# EAGLE board Replicape_B0 (EAGLE 7.2.0), part 1 of 2
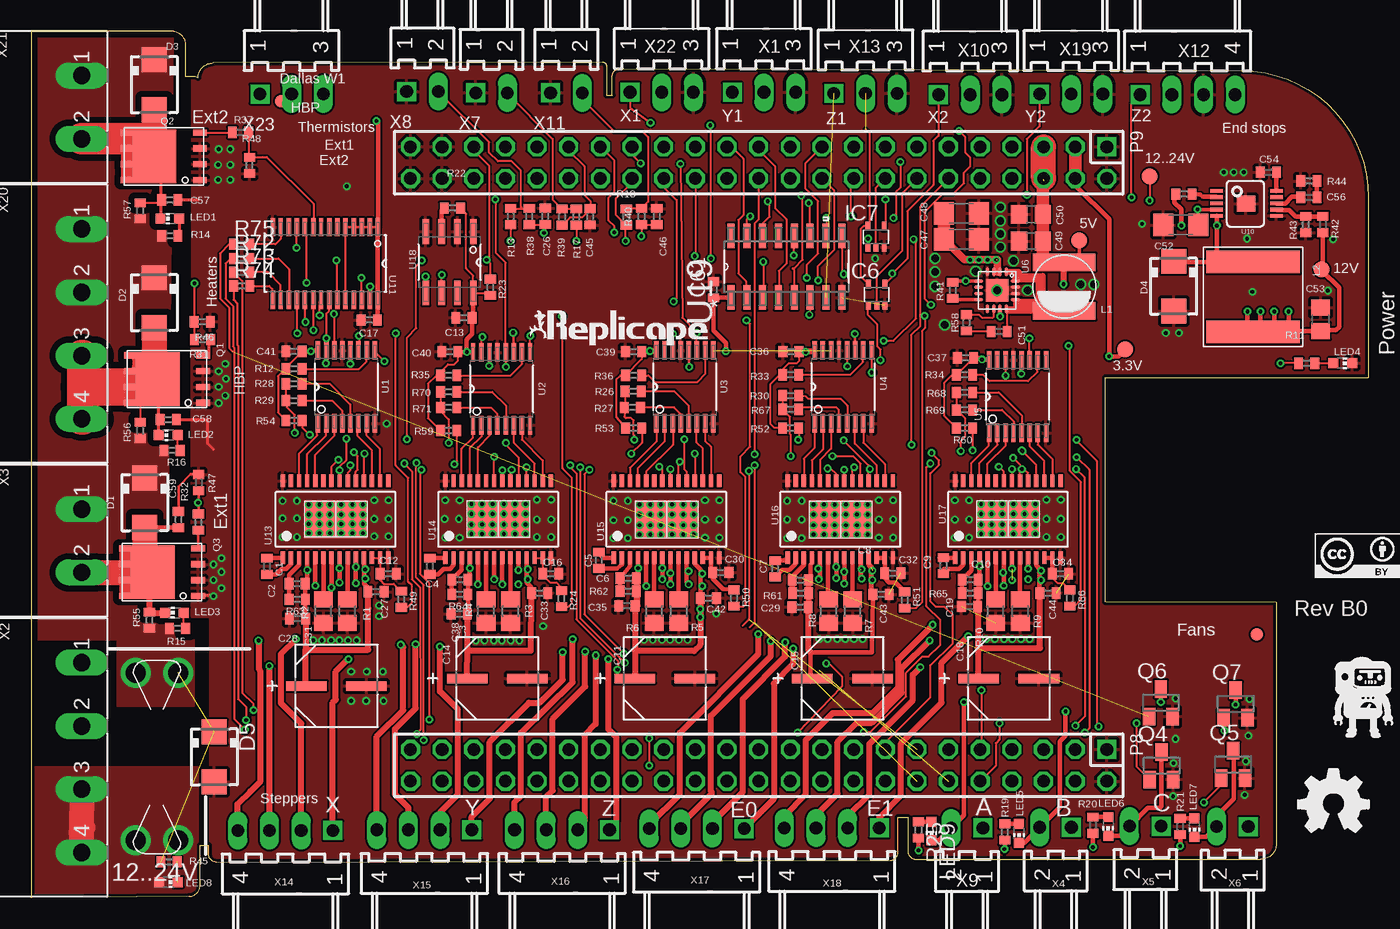
[diagram p5: board, top side]
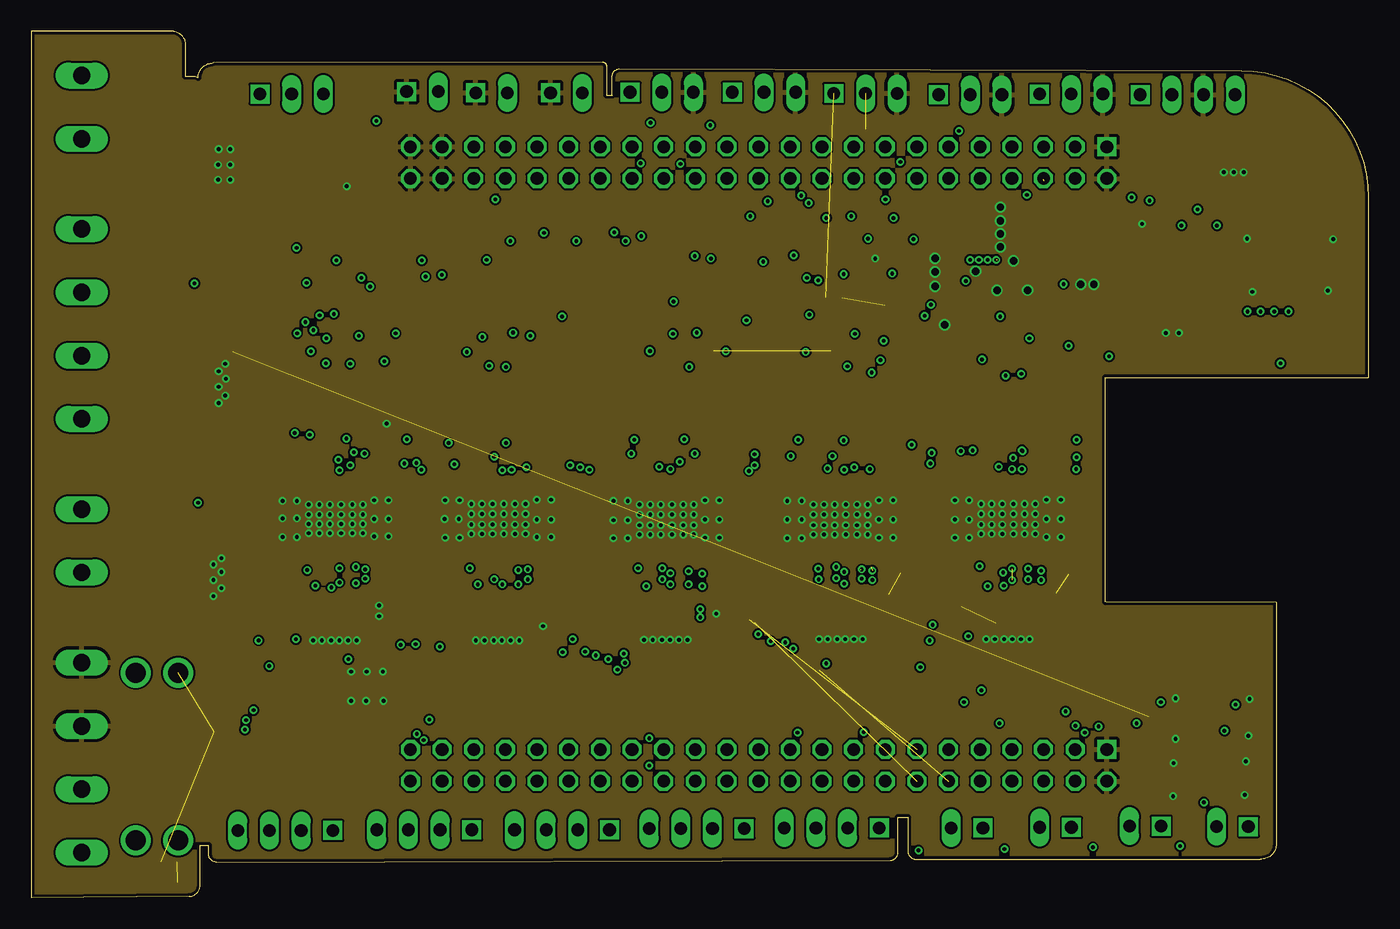
[diagram p6: board, inner layer GND]
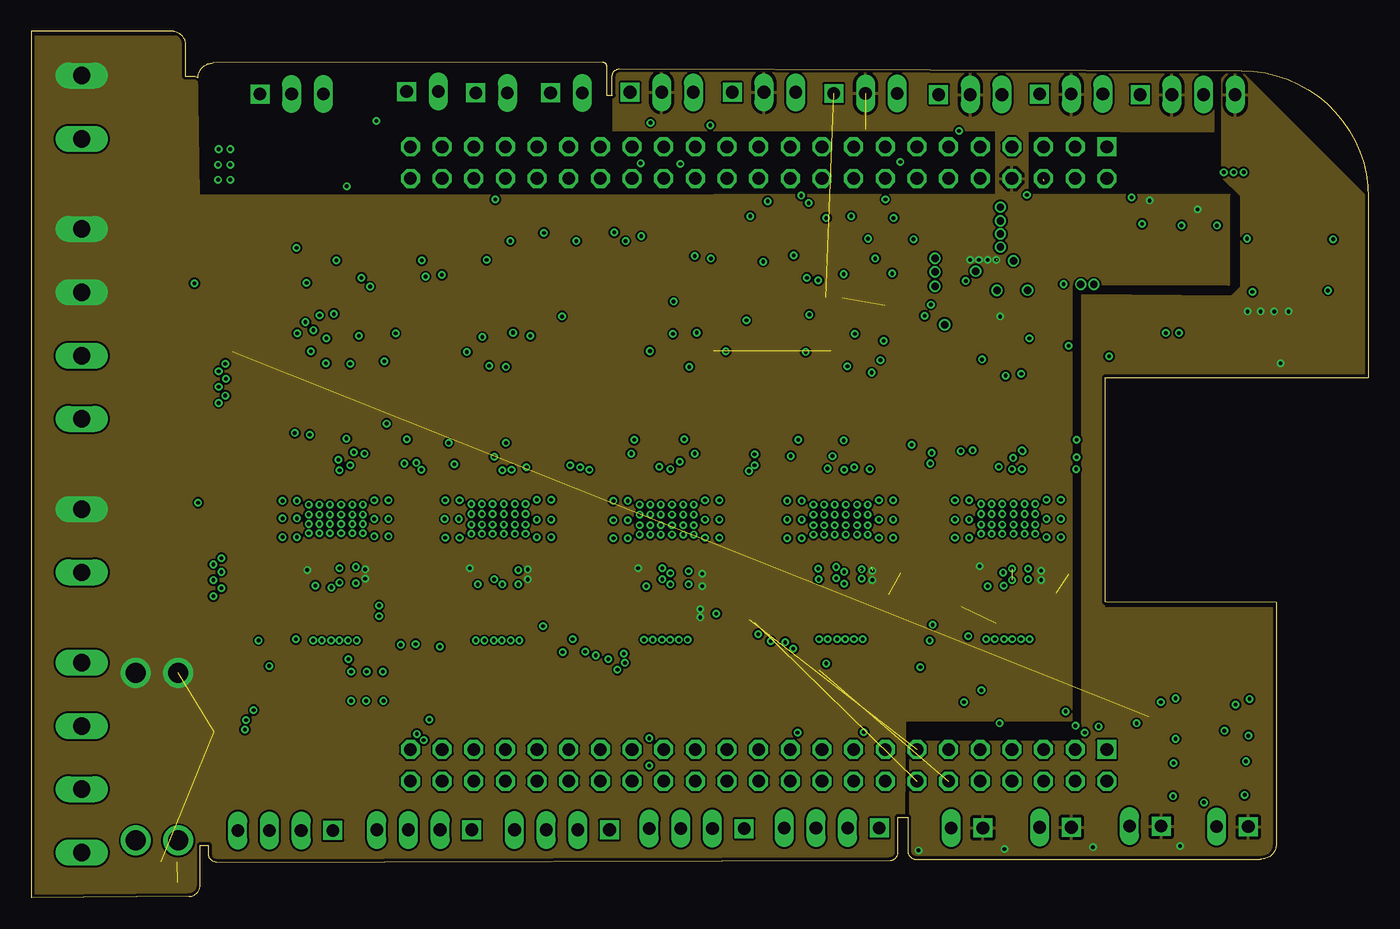
[diagram p7: board, inner layer VCC]
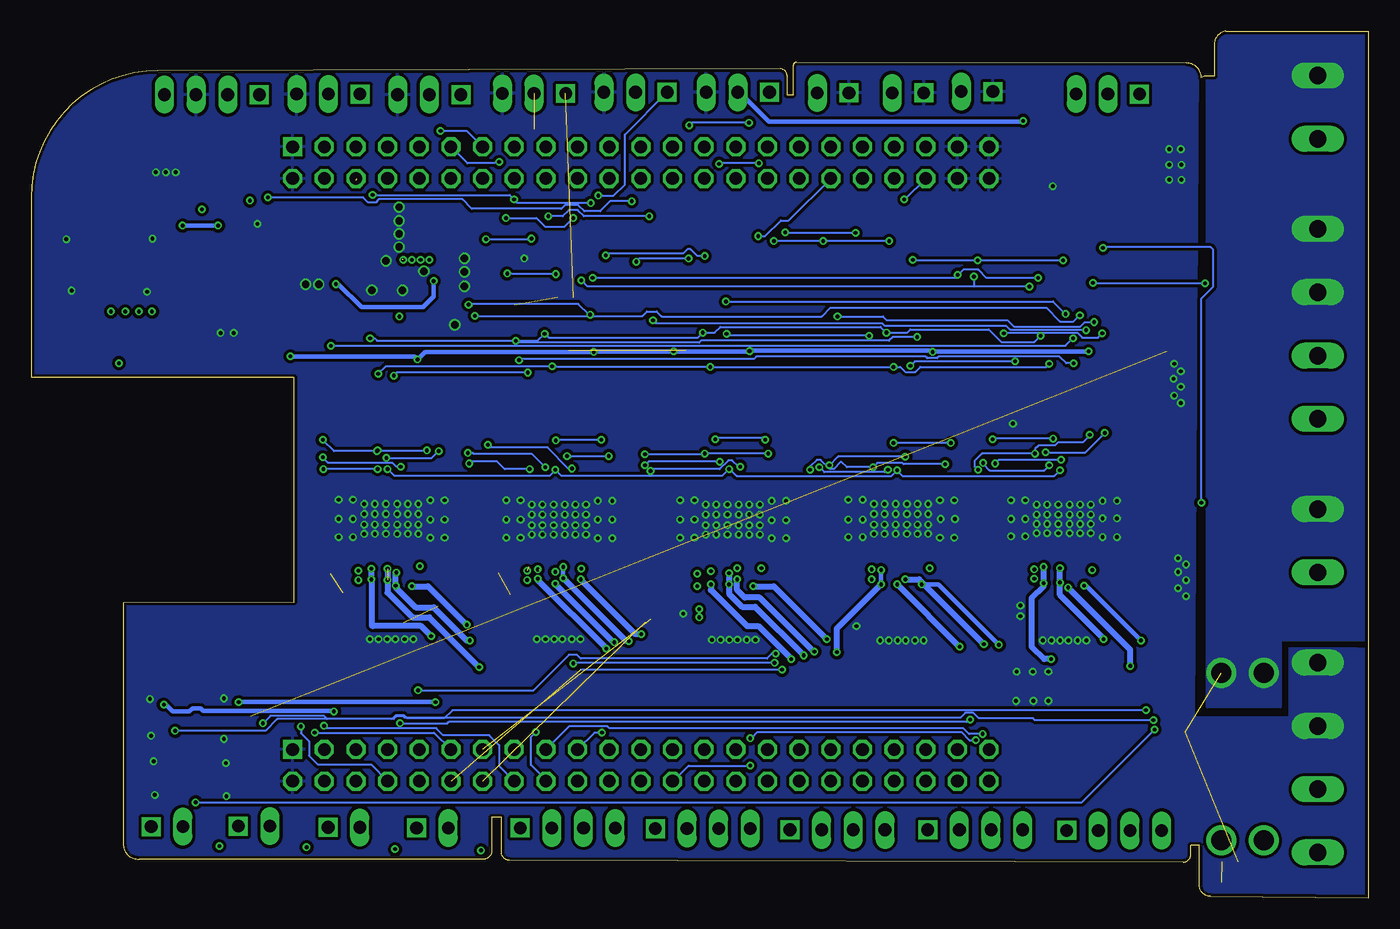
[diagram p8: board, bottom side, seen from below]

Size 107.3 x 69.55 mm. Coordinates in mm from the lower left corner, seen from the top.
Outline: 46.62,64.4 46.62,65.85 arc-90 47.17,66.53 97.15,66.38 arc-90 107.3,56.2 107.3,41.75 86.19,41.75 86.19,23.75 99.9,23.7 99.9,4.2 arc-90 98.65,3.1 70.95,3.1 arc-90 70.35,3.75 70.35,6.45 69.55,6.45 69.55,3.65 arc-90 68.95,3 14.85,2.85 arc-90 14.25,3.5 14.25,4.2 13.55,4.2 13.55,1.05 arc-90 12.7,0.1 0,0 0,69.55 11.43,69.55 arc-90 12.35,68.35 12.35,65.95 13.15,65.95 13.4,65.8 arc-90 14.6,67 45.9,67.05 arc-90 46.15,66.8 46.15,64.4 46.62,64.4
Outline: 46.62,64.4 46.65,64.4
Copper layers (1*2*3*16): Top 0.035mm / dielectric 0.2mm / GND 0.035mm / dielectric 1.06mm / VCC 0.035mm / dielectric 0.2mm / Bottom 0.035mm
Design rules "default *": minimum track width 6mil, minimum drill 0.3mm, track to track 6mil, track to pad 6mil, pad to pad 6mil, via to via 6mil, smd to smd 0mil, copper to edge 10mil, drill to drill 10mil, minimum pad ring 10mil, minimum via ring 6mil, stop-mask expansion 2mil, vias tented up to drill 100mil, thermal gap 10mil
Net classes: 1 power: width 1.27 mm

## Footprints (pad centres in the part's own frame; a part is rotated, then mirrored left to right if it is on the bottom)
B1,27 = smd 1.27 x 1.27: TP 0,0
C0402 = smd 0.7 x 0.9: 1 -0.65,0; 2 0.65,0
CAPAE660X800N = smd 3.251 x 0.762: 1 -2.413,0; 2 2.413,0
C1206 = smd 1.6 x 1.8: 1 -1.4,0; 2 1.4,0
C0805 = smd 1.3 x 1.5: 1 -0.95,0; 2 0.95,0
SMA = smd 2 x 2: A 2,0; C -2,0
3557 = drill 1.6: P$1 -6.73,1.7; P$2 -6.73,-1.7; P$3 6.73,-1.7; P$4 6.73,1.7
SC70-5 = smd 0.4 x 0.7: 1 -0.65,-0.85; 2 0,-0.85; 3 0.65,-0.85; 4 0.65,0.85; 5 -0.65,0.85
FIDUCIAL-1X2.5 = smd 1 x 1: 1 0,0
VLC5020 = smd 1.4 x 5: P$1 1.95,0; P$2 -1.95,0
NR8040T330 = smd 1.8 x 7.5: P$1 2.8,0; P$2 -2.8,0
CHIP-LED0603 = smd 0.8 x 0.8: A 0,-0.75; C 0,0.75
DIL-100-2X23 = drill 1.016 square: 1 -27.94,-1.27 | drill 1.016 octagon: 2 -27.94,1.27; 3 -25.4,-1.27; 4 -25.4,1.27; 5 -22.86,-1.27; 6 -22.86,1.27; 7 -20.32,-1.27; 8 -20.32,1.27; 9 -17.78,-1.27; 10 -17.78,1.27; 11 -15.24,-1.27; 12 -15.24,1.27; 13 -12.7,-1.27; 14 -12.7,1.27; 15 -10.16,-1.27; 16 -10.16,1.27; 17 -7.62,-1.27; 18 -7.62,1.27; 19 -5.08,-1.27; 20 -5.08,1.27; 21 -2.54,-1.27; 22 -2.54,1.27; 23 0,-1.27; 24 0,1.27; 25 2.54,-1.27; 26 2.54,1.27; 27 5.08,-1.27; 28 5.08,1.27; 29 7.62,-1.27; 30 7.62,1.27; 31 10.16,-1.27; 32 10.16,1.27; 33 12.7,-1.27; 34 12.7,1.27; 35 15.24,-1.27; 36 15.24,1.27; 37 17.78,-1.27; 38 17.78,1.27; 39 20.32,-1.27; 40 20.32,1.27; 41 22.86,-1.27; 42 22.86,1.27; 43 25.4,-1.27; 44 25.4,1.27; 45 27.94,-1.27; 46 27.94,1.27
8-DFN-EP-(5X6) = smd 1.1 x 0.5: 1 -2.9,1.905; 2 -2.9,0.635; 3 -2.9,-0.635; 4 -2.9,-1.905; 5 2.9,-1.905; 6 2.9,-0.635; 7 2.9,0.635; 8 2.9,1.905 | smd 3.5 x 4.3: TH 0.75,0
SOT23 = smd 1 x 1.4: 1 -0.95,-1.1; 2 0.95,-1.1; 3 0,1.1
R0805 = smd 1.3 x 1.5: 1 -0.95,0; 2 0.95,0
R0402 = smd 0.7 x 0.9: 1 -0.65,0; 2 0.65,0
SOP65P640X120-16N = smd 1.473 x 0.356: 1 -2.921,2.286; 2 -2.921,1.626; 3 -2.921,0.965; 4 -2.921,0.33; 5 -2.921,-0.33; 6 -2.921,-0.965; 7 -2.921,-1.626; 8 -2.921,-2.286; 9 2.921,-2.286; 10 2.921,-1.626; 11 2.921,-0.965; 12 2.921,-0.33; 13 2.921,0.33; 14 2.921,0.965; 15 2.921,1.626; 16 2.921,2.286
QFN-16 = smd 0.75 x 0.3: 1 -1.475,0.75; 2 -1.475,0.25; 3 -1.475,-0.25; 4 -1.475,-0.75; 9 1.475,-0.75; 10 1.475,-0.25; 11 1.475,0.25; 12 1.475,0.75 | smd 0.3 x 0.75: 5 -0.75,-1.475; 6 -0.25,-1.475; 7 0.25,-1.475; 8 0.75,-1.475; 13 0.75,1.475; 14 0.25,1.475; 15 -0.25,1.475; 16 -0.75,1.475 | smd 1.8 x 1.8: P$17 0,0
MSOP10 = smd 0.3 x 1: 1 -1,-2.4; 2 -0.5,-2.4; 3 0.005,-2.4; 4 0.5,-2.4; 5 1,-2.4; 6 1,2.4; 7 0.5,2.4; 8 0.005,2.4; 9 -0.5,2.4; 10 -1,2.4 | smd 1.3 x 1.5: EP 0.02,-0.04
SOP65P640X110-28N = smd 1.473 x 0.356: 1 -2.921,4.216; 2 -2.921,3.581; 3 -2.921,2.921; 4 -2.921,2.286; 5 -2.921,1.626; 6 -2.921,0.965; 7 -2.921,0.33; 8 -2.921,-0.33; 9 -2.921,-0.965; 10 -2.921,-1.626; 11 -2.921,-2.286; 12 -2.921,-2.921; 13 -2.921,-3.581; 14 -2.921,-4.216; 15 2.921,-4.216; 16 2.921,-3.581; 17 2.921,-2.921; 18 2.921,-2.286; 19 2.921,-1.626; 20 2.921,-0.965; 21 2.921,-0.33; 22 2.921,0.33; 23 2.921,0.965; 24 2.921,1.626; 25 2.921,2.286; 26 2.921,2.921; 27 2.921,3.581; 28 2.921,4.216
TSSOP-28 = smd 0.35 x 1: 1 -4.225,-3.087; 2 -3.575,-3.087; 3 -2.925,-3.087; 4 -2.275,-3.087; 5 -1.625,-3.087; 6 -0.975,-3.087; 7 -0.325,-3.087; 8 0.325,-3.087; 9 0.975,-3.087; 10 1.625,-3.087; 11 2.275,-3.087; 12 2.925,-3.087; 13 3.575,-3.087; 14 4.225,-3.087; 15 4.225,3.087; 16 3.575,3.087; 17 2.925,3.087; 18 2.275,3.087; 19 1.625,3.087; 20 0.975,3.087; 21 0.325,3.087; 22 -0.325,3.087; 23 -0.975,3.087; 24 -1.625,3.087; 25 -2.275,3.087; 26 -2.925,3.087; 27 -3.575,3.087; 28 -4.225,3.087 | smd 5 x 3: EXP 0,0
SOIC127P600X175-8N = smd 1.981 x 0.533: 1 -2.464,1.905; 2 -2.464,0.635; 3 -2.464,-0.635; 4 -2.464,-1.905; 5 2.464,-1.905; 6 2.464,-0.635; 7 2.464,0.635; 8 2.464,1.905
SOIC127P600X175-16N = smd 1.981 x 0.559: 1 -2.464,4.445; 2 -2.464,3.175; 3 -2.464,1.905; 4 -2.464,0.635; 5 -2.464,-0.635; 6 -2.464,-1.905; 7 -2.464,-3.175; 8 -2.464,-4.445; 9 2.464,-4.445; 10 2.464,-3.175; 11 2.464,-1.905; 12 2.464,-0.635; 13 2.464,0.635; 14 2.464,1.905; 15 2.464,3.175; 16 2.464,4.445
7395-03 = drill 1.016 square: 1 2.54,0 | drill 1.016 long: 2 0,0; 3 -2.54,0
MSTBA4 = drill 1.397 long: 1 -7.62,5.08; 2 -2.54,5.08; 3 2.54,5.08; 4 7.62,5.08
MSTBA2 = drill 1.397 long: 1 -2.54,5.08; 2 2.54,5.08
7395-02 = drill 1.016 square: 1 1.27,0 | drill 1.016 long: 2 -1.27,0
7395-04 = drill 1.016 square: 1 3.81,0 | drill 1.016 long: 2 1.27,0; 3 -1.27,0; 4 -3.81,0

## Placement (x,y rotation side)
3.3V  TPB1,27  [B1,27]  87.8,44.02 0 top
5V  TPB1,27  [B1,27]  84.1,52.75 270 top
12..24V  TPB1,27  [B1,27]  89.75,57.9 0 top
12V  TPB1,27  [B1,27]  103.55,50.42 0 top
C1  10nF  [C0402]  18.93,26.59 90 top
C2  0.1uF  [C0402]  21.34,25.2 180 top
C3  10nF  [C0402]  32,26.6 90 top
C4  0.1uF  [C0402]  34.4,25.52 180 top
C5  10nF  [C0402]  45.55,27.07 90 top
C6  0.1uF  [C0402]  47.9,25.64 180 top
C7  10nF  [C0402]  59.7,26.4 90 top
C8  0.1uF  [C0402]  61.73,25.5 180 top
C9  10nF  [C0402]  73.2,26.65 90 top
C10  0.1uF  [C0402]  75.35,25.52 180 top
C11  100UF  [CAPAE660X800N]  50.85,17.6 0 top
C12  4.7uF  [C0402]  28.65,26 0 top
C13  0.1uF  [C0402]  34.73,46.55 180 top
C14  100UF  [CAPAE660X800N]  37.4,17.6 0 top
C15  100UF  [CAPAE660X800N]  65.1,17.6 0 top
C16  4.7uF  [C0402]  41.7,26 0 top
C17  0.1uF  [C0402]  27.13,46.37 180 top
C18  100UF  [CAPAE660X800N]  78.45,17.6 0 top
C19  0.1uF  [C0402]  75.3,23.38 180 top
C26  4.7uF  [C0402]  41.25,54.7 90 top
C27  0.1uF  [C0402]  27.68,24.56 0 top
C28  100UF  [CAPAE660X800N]  24.5,17 0 top
C29  0.1uF  [C0402]  61.7,23.32 180 top
C30  4.7uF  [C0402]  55.35,26.1 0 top
C31  0.1uF  [C0402]  21.38,22.41 180 top
C32  4.7uF  [C0402]  69.15,26.05 0 top
C33  0.1uF  [C0402]  40.8,24.45 0 top
C34  4.7uF  [C0402]  82.6,26 0 top
C35  0.1uF  [C0402]  47.8,23.43 180 top
C36  0.1uF  [C0402]  60.97,43.83 180 top
C37  0.1uF  [C0402]  74.98,43.33 180 top
C38  0.1uF  [C0402]  34.35,22.77 180 top
C39  0.1uF  [C0402]  48.34,43.83 180 top
C40  0.1uF  [C0402]  33.59,43.83 180 top
C41  0.1uF  [C0402]  21.09,43.85 180 top
C42  0.1uF  [C0402]  54.35,24.05 0 top
C43  0.1uF  [C0402]  68.2,24.35 0 top
C44  0.1uF  [C0402]  81.6,24.45 0 top
C45  4.7uF  [C0402]  44.85,54.65 270 top
C46  4.7uF  [C0402]  50.2,54.67 90 top
C47  10uF  [C1206]  74.65,54.92 0 top
C48  10uF  [C1206]  74.65,52.85 0 top
C49  22uF  [C0805]  80.22,52.7 180 top
C50  22uF  [C0805]  80.22,54.85 180 top
C51  22nF  [C0402]  77.67,45.45 0 top
C52  10uF  [C1206]  92.25,54 180 top
C53  22uF  [C0805]  103.47,46.42 90 top
C54  10nF  [C0402]  99.28,58.23 180 top
C55  10nF  [C0402]  92.5,56.48 180 top
C56  1nF  [C0402]  102.53,56.2 0 top
C57  4.7nF  [C0402]  11.12,56 0 top
C58  4.7nF  [C0402]  11,38.38 0 top
C59  4.7nF  [C0402]  11.82,30.35 90 top
C61  0.1uF  [C0402]  54.75,48.8 90 top
D1  MBRA340T3  [SMA]  9.12,31.7 270 top
D2  MBRA340T3  [SMA]  9.88,47.75 270 top
D3  MBRA340T3  [SMA]  9.88,65.25 270 top
D4  MBRA340T3  [SMA]  91.67,49.08 270 top
D5  MBRA340T3  [SMA]  14.7,11.3 270 top
F1  FUSE  [3557]  10.1,11.33 90 top
IC6  74AHC1G126DCK  [SC70-5]  67.85,48.4 0 top
IC7  74AHC1G126DCK  [SC70-5]  67.8,53.05 0 top
JP1  FIDUCIAL1X2.5  [FIDUCIAL-1X2.5]  20.07,63.92 0 top
JP2  FIDUCIAL1X2.5  [FIDUCIAL-1X2.5]  98.35,21.15 0 top
L1  4.7uH  [VLC5020]  82.9,49.05 270 top
L2  33uH  [NR8040T330]  98.05,48.23 270 top
LED1  blue  [CHIP-LED0603]  11.12,54.5 90 top
LED2  blue  [CHIP-LED0603]  11,37.12 90 top
LED3  blue  [CHIP-LED0603]  11.5,22.88 90 top
LED4  blue  [CHIP-LED0603]  105.25,42.9 270 top
LED5  blue  [CHIP-LED0603]  79.28,5.17 180 top
LED6  blue  [CHIP-LED0603]  86.42,5.72 180 top
LED7  blue  [CHIP-LED0603]  93.35,5.62 180 top
LED8  blue  [CHIP-LED0603]  11.03,1.25 270 top
LED9  blue  [CHIP-LED0603]  72.25,5.35 180 top
LOGO1  OSHW_LOGO_FILLX0200-NT  [OSHW_FILLX200_NOTEXT]  101.66,5.26 0 top
P8  F-2X23-  [DIL-100-2X23]  58.38,10.62 180 top
P9  F-2X23-  [DIL-100-2X23]  58.38,59 180 top
Q1  AON6758  [8-DFN-EP-(5X6)]  10.9,41.62 180 top
Q2  AON6758  [8-DFN-EP-(5X6)]  10.65,59.5 180 top
Q3  AON6758  [8-DFN-EP-(5X6)]  10.5,26.12 180 top
Q4  [SOT23]  90.7,10.6 0 top
Q5  [SOT23]  96.45,10.7 0 top
Q6  [SOT23]  90.65,15.65 0 top
Q7  [SOT23]  96.65,15.55 0 top
R1  0.1R  [R0805]  25.38,23 90 top
R2  0.1R  [R0805]  23.45,23 90 top
R3  0.1R  [R0805]  38.48,23 90 top
R4  0.1R  [R0805]  36.5,23 90 top
R5  0.1R  [R0805]  51.98,23 90 top
R6  0.1R  [R0805]  50,23 90 top
R7  0.1R  [R0805]  65.92,23 90 top
R8  0.1R  [R0805]  64,23 90 top
R9  0.1R  [R0805]  79.38,23 90 top
R10  0.1R  [R0805]  77.4,23 90 top
R11  4.7K  [R0402]  102.35,42.9 180 top
R12  4.7K  [R0402]  21.1,42.45 180 top
R13  4K7, 1%  [R0402]  38.48,54.67 270 top
R14  4.7K  [R0402]  11.12,53.12 180 top
R15  4.7K  [R0402]  11.75,21.62 180 top
R16  4.7K  [R0402]  11.3,35.9 180 top
R17  4K7, 1%  [R0402]  43.75,54.62 270 top
R18  4K7, 1%  [R0402]  47.75,54.62 270 top
R19  4.7K  [R0402]  78.12,5.28 270 top
R20  4.7K  [R0402]  85.2,5.83 270 top
R21  4.7K  [R0402]  92.2,5.72 270 top
R22  4.7K  [R0402]  33.8,55.35 0 top
R23  4.7K  [R0402]  36.85,49 270 top
R24  10K  [R0402]  42.55,24 270 top
R25  4.7K  [R0402]  71.2,5.45 270 top
R26  4.7K  [R0402]  48.3,40.65 0 top
R27  4.7K  [R0402]  48.25,39.35 0 top
R28  4.7K  [R0402]  21.1,41.25 0 top
R29  4.7K  [R0402]  21.1,39.9 0 top
R30  4.7K  [R0402]  60.95,40.3 0 top
R31  470R  [R0402]  13.75,44.8 180 top
R32  470R  [R0402]  13.43,30.15 90 top
R33  4.7K  [R0402]  60.95,41.98 180 top
R34  4.7K  [R0402]  74.9,41.98 180 top
R35  4.7K  [R0402]  33.5,41.92 180 top
R36  4.7K  [R0402]  48.35,41.92 180 top
R37  470R  [R0402]  16.8,61.42 0 top
R38  10K  [R0402]  39.98,54.67 270 top
R39  10K  [R0402]  42.6,54.62 270 top
R40  10K  [R0402]  48.98,54.67 270 top
R41  10K  [R0402]  73.95,48.75 90 top
R42  120K  [R0402]  103.65,54.02 90 top
R43  10K  [R0402]  102.28,54.02 270 top
R44  40K  [R0402]  102.53,57.52 180 top
R45  4.7K  [R0402]  11.07,2.88 0 top
R46  4.7K  [R0402]  13.72,46.23 180 top
R47  4.7K  [R0402]  13.45,33.33 270 top
R48  4.7K  [R0402]  17.52,58.77 90 top
R49  10K  [R0402]  29.7,23.95 270 top
R50  10K  [R0402]  56.4,24.05 270 top
R51  10K  [R0402]  70.1,23.9 270 top
R52  4.7K  [R0402]  60.95,37.7 180 top
R53  4.7K  [R0402]  48.35,37.7 180 top
R54  4.7K  [R0402]  21.1,38.3 180 top
R55  4.7K  [R0402]  9.5,22.27 270 top
R56  4.7K  [R0402]  8.75,37.5 270 top
R57  4.7K  [R0402]  8.75,55.12 270 top
R58  100R  [R0402]  75.05,46.15 90 top
R59  4.7K  [R0402]  33.5,37.5 180 top
R60  4.7K  [R0402]  74.9,37.7 180 top
R61  1M  [R0402]  61.75,24.45 180 top
R62  1M  [R0402]  47.9,24.6 180 top
R63  1M  [R0402]  21.35,23.95 180 top
R64  1M  [R0402]  34.4,24.35 180 top
R65  1M  [R0402]  75.35,24.45 180 top
R66  10K  [R0402]  83.35,24.05 270 top
R67  4.7K  [R0402]  60.95,39.2 0 top
R68  4.7K  [R0402]  74.9,40.55 0 top
R69  4.7K  [R0402]  74.9,39.15 0 top
R70  4.7K  [R0402]  33.5,40.6 0 top
R71  4.7K  [R0402]  33.5,39.35 0 top
R72  470R  [R0402]  16.9,51.3 0 top
R73  470R  [R0402]  16.9,50.2 0 top
R74  470R  [R0402]  16.9,49.1 0 top
R75  470R  [R0402]  16.9,52.45 0 top
U1  SN74AHC595PW  [SOP65P640X120-16N]  25.3,41 90 top
U2  SN74AHC595PW  [SOP65P640X120-16N]  37.75,40.85 90 top
U3  SN74AHC595PW  [SOP65P640X120-16N]  52.45,41 90 top
U4  SN74AHC595PW  [SOP65P640X120-16N]  65.15,41 90 top
U5  SN74AHC595PW  [SOP65P640X120-16N]  79.15,40.23 90 top
U6  MCP16321  [QFN-16]  77.5,48.75 270 top
U10  RT8268  [MSOP10]  97.53,55.73 270 top
U11  PCA9685PW  [SOP65P640X110-28N]  23.6,50.9 270 top
U13  DRV8825PWP  [TSSOP-28]  24.43,30.38 0 top
U14  DRV8825PWP  [TSSOP-28]  37.48,30.38 0 top
U15  DRV8825PWP  [TSSOP-28]  50.98,30.38 0 top
U16  DRV8825PWP  [TSSOP-28]  64.92,30.38 0 top
U17  DRV8825PWP  [TSSOP-28]  78.38,30.38 0 top
U18  CAT24C256  [SOIC127P600X175-8N]  33.58,51 270 top
U19  CD4050BD  [SOIC127P600X175-16N]  60.6,50.65 90 top
U$1  [LOGO_BIG]  106.45,16.15 0 top
U$2  REPLICAPE-LOGO  [REPLICAPE-LOGO]  39.62,43.79 0 top
U$3  CC-BY-SA  [CC-BY-SA]  108.3,27.9 0 top
X1  22-05-7038-03  [7395-03]  58.8,64.65 180 top
X2  MSTBA4  [MSTBA4]  -1.02,11.25 270 top
X3  MSTBA2  [MSTBA2]  -1.02,28.65 270 top
X4  22-05-7028-02  [7395-02]  82.2,5.65 0 top
X5  22-05-7028-02  [7395-02]  89.4,5.75 0 top
X6  22-05-7028-02  [7395-02]  96.4,5.7 0 top
X7  22-05-7028-02  [7395-02]  36.95,64.6 180 top
X8  22-05-7028-02  [7395-02]  31.4,64.7 180 top
X9  22-05-7028-02  [7395-02]  75.1,5.6 0 top
X10  22-05-7038-03  [7395-03]  75.35,64.45 180 top
X11  22-05-7028-02  [7395-02]  42.95,64.6 180 top
X12  22-05-7048-04  [7395-04]  92.8,64.45 180 top
X13  22-05-7038-03  [7395-03]  66.95,64.55 180 top
X14  22-05-7048-04  [7395-04]  20.4,5.4 0 top
X15  22-05-7048-04  [7395-04]  31.55,5.45 0 top
X16  22-05-7048-04  [7395-04]  42.6,5.45 0 top
X17  22-05-7048-04  [7395-04]  53.4,5.55 0 top
X18  22-05-7048-04  [7395-04]  64.25,5.6 0 top
X19  22-05-7038-03  [7395-03]  83.45,64.5 180 top
X20  MSTBA4  [MSTBA4]  -1.02,46.05 270 top
X21  MSTBA2  [MSTBA2]  -1.02,63.45 270 top
X22  22-05-7038-03  [7395-03]  50.6,64.65 180 top
X23  22-05-7038-03  [7395-03]  20.9,64.5 180 top